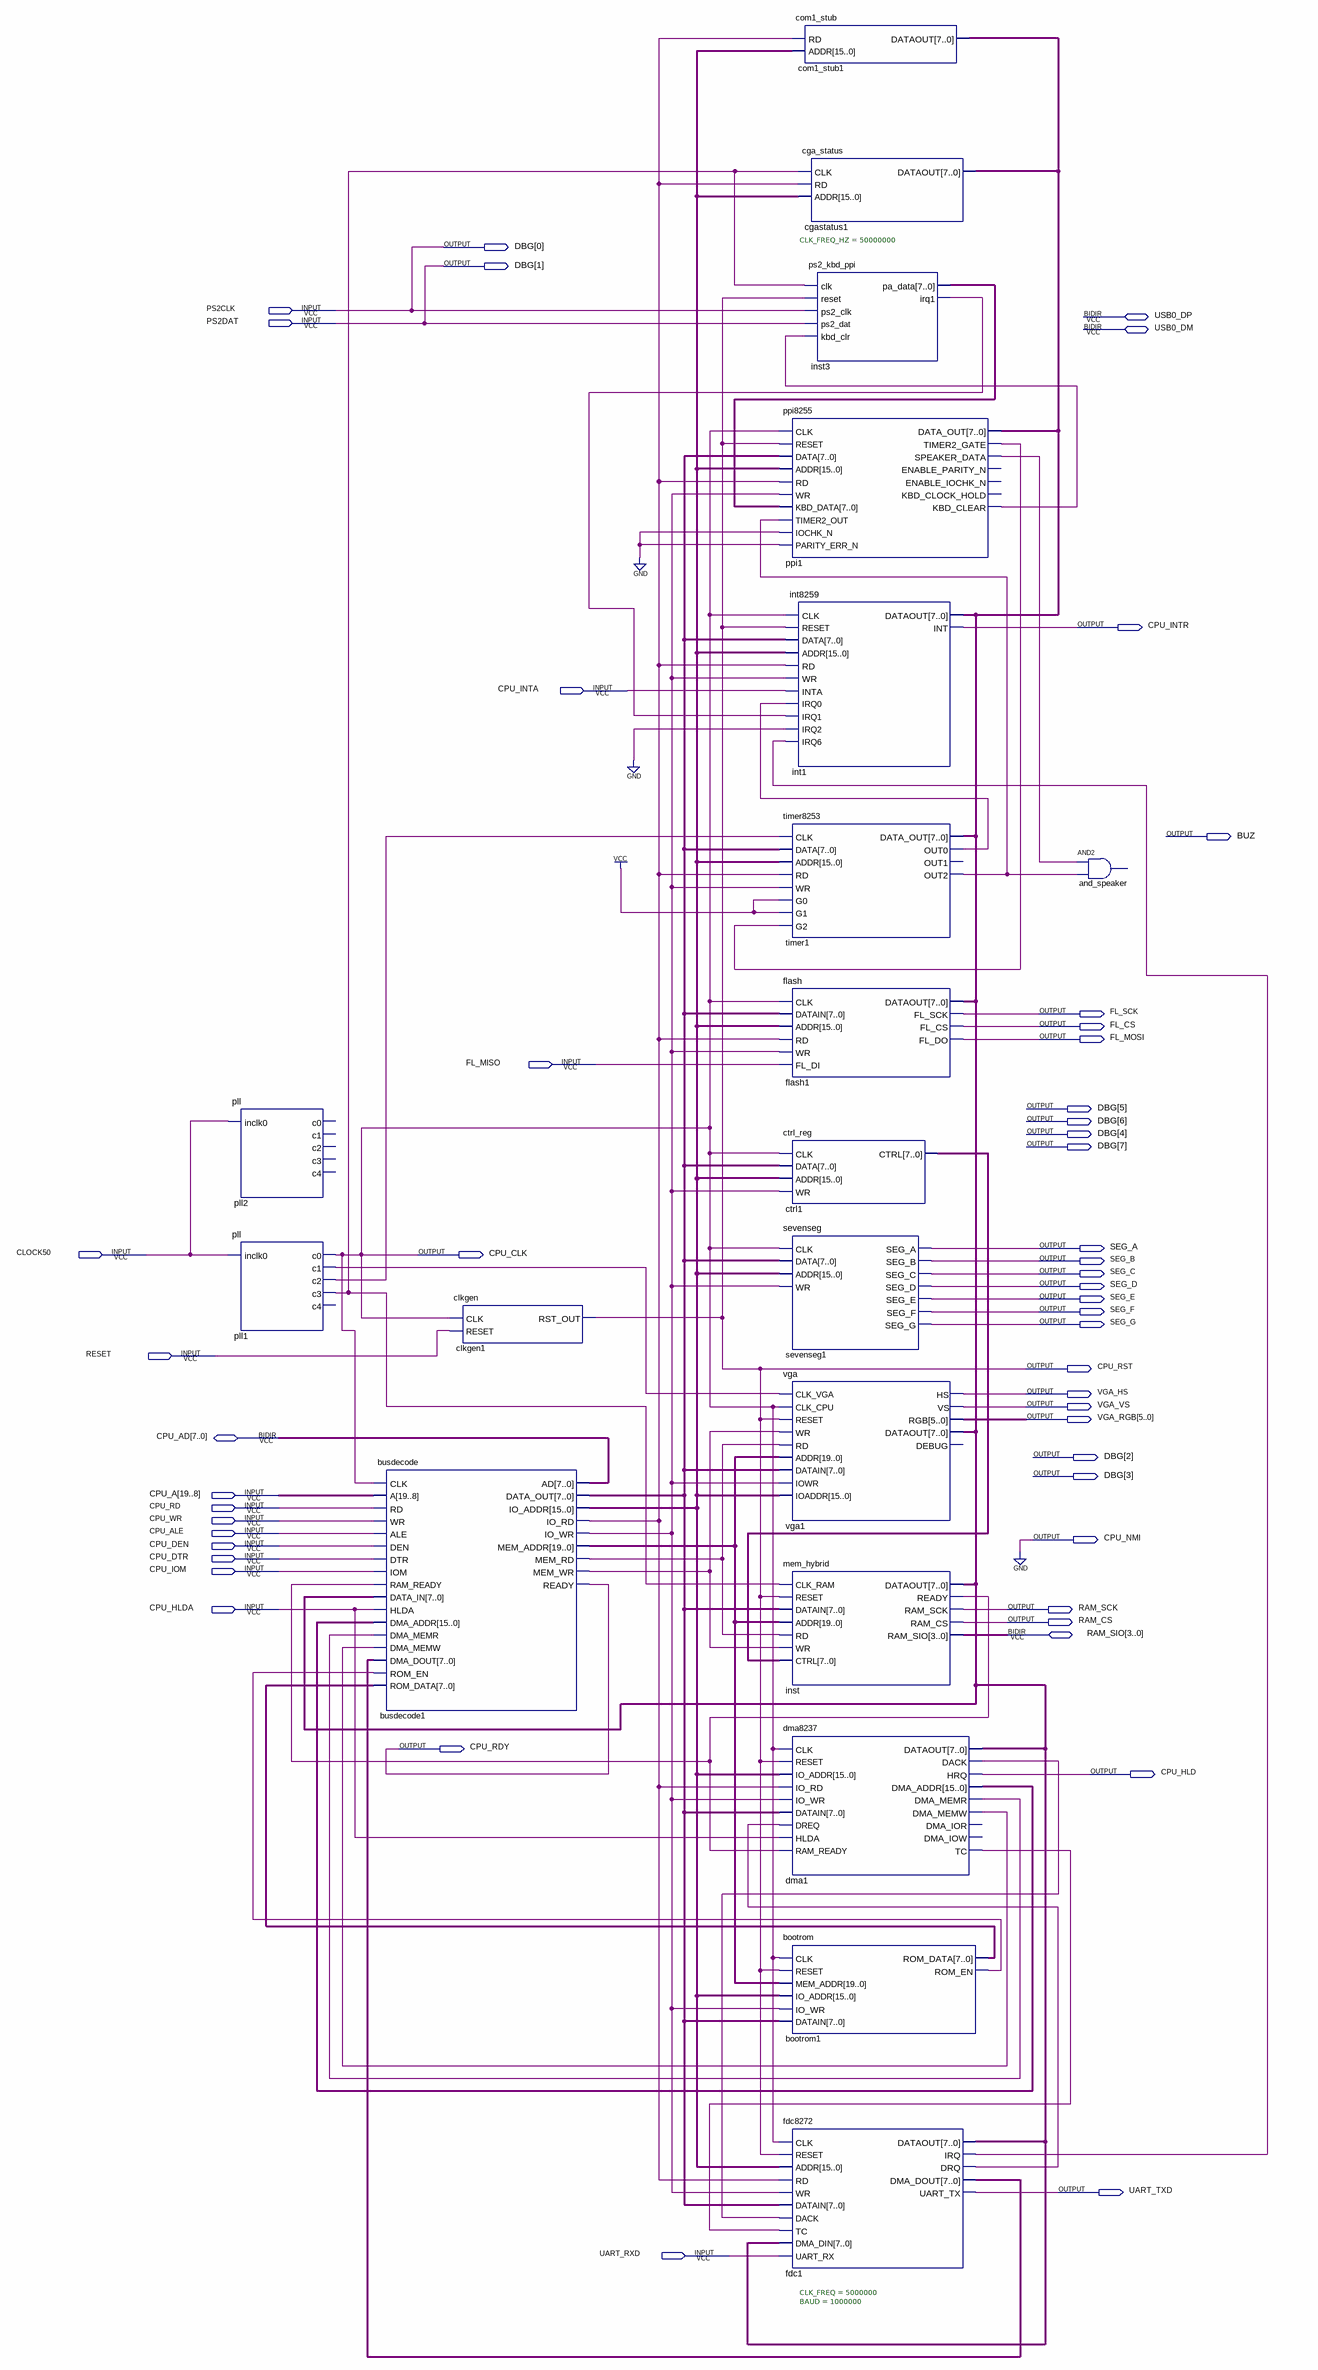
[diagram p0: schematic sheet]
// Quartus schematic gertieboard.bdf as structural Verilog: 19 symbols, 50 pins
module gertieboard (
  input  PS2CLK,
  input  PS2DAT,
  input  CPU_INTA,
  input  FL_MISO,
  input  CLOCK50,
  input  RESET,
  input  [19:8] CPU_A,
  input  CPU_RD,
  input  CPU_WR,
  input  CPU_ALE,
  input  CPU_DEN,
  input  CPU_DTR,
  input  CPU_IOM,
  input  CPU_HLDA,
  input  UART_RXD,
  inout  USB0_DP,
  inout  USB0_DM,
  inout  [7:0] CPU_AD,
  inout  [3:0] RAM_SIO,
  output [7:0] DBG,
  output CPU_INTR,
  output BUZ,
  output FL_SCK,
  output FL_CS,
  output FL_MOSI,
  output SEG_A,
  output CPU_CLK,
  output SEG_B,
  output SEG_C,
  output SEG_D,
  output SEG_E,
  output SEG_F,
  output SEG_G,
  output CPU_RST,
  output VGA_HS,
  output VGA_VS,
  output [5:0] VGA_RGB,
  output CPU_NMI,
  output RAM_SCK,
  output RAM_CS,
  output CPU_RDY,
  output CPU_HLD,
  output UART_TXD
);

  wire bootrom1_rom_en, busdecode1_io_rd, busdecode1_io_wr, busdecode1_mem_rd, busdecode1_mem_wr, dma1_dack,
       dma1_dma_memr, dma1_dma_memw, dma1_tc, fdc1_drq, fdc1_irq, inst3_irq1, inst_ready, pll1_c1, pll1_c2,
       pll1_c3, ppi1_kbd_clear, ppi1_speaker_data, ppi1_timer2_gate, timer1_out0, timer1_out2;
  wire [7:0] bootrom1_rom_data, busdecode1_data_out, com1_stub1_dataout, ctrl1_ctrl, fdc1_dma_dout,
       inst3_pa_data;
  wire [15:0] busdecode1_io_addr, dma1_dma_addr;
  wire [19:0] busdecode1_mem_addr;

  pll pll2 (.inclk0(CLOCK50));  // open: c0, c1, c2, c3, c4
  pll pll1 (.inclk0(CLOCK50), .c0(CPU_CLK), .c1(pll1_c1), .c2(pll1_c2), .c3(pll1_c3));  // open: c4
  busdecode busdecode1 (
    .CLK(CPU_CLK), .A(CPU_A), .RD(CPU_RD), .WR(CPU_WR), .ALE(CPU_ALE), .DEN(CPU_DEN), .DTR(CPU_DTR),
    .IOM(CPU_IOM), .RAM_READY(inst_ready), .DATA_IN(com1_stub1_dataout), .HLDA(CPU_HLDA),
    .DMA_ADDR(dma1_dma_addr), .DMA_MEMR(dma1_dma_memr), .DMA_MEMW(dma1_dma_memw), .DMA_DOUT(fdc1_dma_dout),
    .ROM_EN(bootrom1_rom_en), .ROM_DATA(bootrom1_rom_data), .DATA_OUT(busdecode1_data_out),
    .IO_ADDR(busdecode1_io_addr), .IO_RD(busdecode1_io_rd), .IO_WR(busdecode1_io_wr),
    .MEM_ADDR(busdecode1_mem_addr), .MEM_RD(busdecode1_mem_rd), .MEM_WR(busdecode1_mem_wr), .READY(CPU_RDY),
    .AD(CPU_AD));
  clkgen clkgen1 (.CLK(CPU_CLK), .RESET(RESET), .RST_OUT(CPU_RST));
  com1_stub com1_stub1 (.RD(busdecode1_io_rd), .ADDR(busdecode1_io_addr), .DATAOUT(com1_stub1_dataout));
  cga_status cgastatus1 (.CLK(pll1_c3), .RD(busdecode1_io_rd), .ADDR(busdecode1_io_addr), .DATAOUT(com1_stub1_dataout));
  ps2_kbd_ppi #(.CLK_FREQ_HZ(50000000)) inst3 (
    .clk(pll1_c3), .reset(CPU_RST), .ps2_clk(PS2CLK), .ps2_dat(PS2DAT), .kbd_clr(ppi1_kbd_clear),
    .pa_data(inst3_pa_data), .irq1(inst3_irq1));
  ppi8255 ppi1 (
    .CLK(CPU_CLK), .RESET(CPU_RST), .DATA(busdecode1_data_out), .ADDR(busdecode1_io_addr),
    .RD(busdecode1_io_rd), .WR(busdecode1_io_wr), .KBD_DATA(inst3_pa_data), .TIMER2_OUT(timer1_out2),
    .IOCHK_N(1'b0), .PARITY_ERR_N(1'b0), .DATA_OUT(com1_stub1_dataout), .TIMER2_GATE(ppi1_timer2_gate),
    .SPEAKER_DATA(ppi1_speaker_data), .KBD_CLEAR(ppi1_kbd_clear));  // open: ENABLE_PARITY_N, ENABLE_IOCHK_N, KBD_CLOCK_HOLD
  int8259 int1 (
    .CLK(CPU_CLK), .RESET(CPU_RST), .DATA(busdecode1_data_out), .ADDR(busdecode1_io_addr),
    .RD(busdecode1_io_rd), .WR(busdecode1_io_wr), .INTA(CPU_INTA), .IRQ0(timer1_out0), .IRQ1(inst3_irq1),
    .IRQ2(1'b0), .IRQ6(fdc1_irq), .DATAOUT(com1_stub1_dataout), .INT(CPU_INTR));
  timer8253 timer1 (
    .CLK(pll1_c2), .DATA(busdecode1_data_out), .ADDR(busdecode1_io_addr), .RD(busdecode1_io_rd),
    .WR(busdecode1_io_wr), .G0(1'b1), .G1(1'b1), .G2(ppi1_timer2_gate), .DATA_OUT(com1_stub1_dataout),
    .OUT0(timer1_out0), .OUT2(timer1_out2));  // open: OUT1
  flash flash1 (
    .CLK(CPU_CLK), .DATAIN(busdecode1_data_out), .ADDR(busdecode1_io_addr), .RD(busdecode1_io_rd),
    .WR(busdecode1_io_wr), .FL_DI(FL_MISO), .DATAOUT(com1_stub1_dataout), .FL_SCK(FL_SCK), .FL_CS(FL_CS),
    .FL_DO(FL_MOSI));
  ctrl_reg ctrl1 (
    .CLK(CPU_CLK), .DATA(busdecode1_data_out), .ADDR(busdecode1_io_addr), .WR(busdecode1_io_wr),
    .CTRL(ctrl1_ctrl));
  sevenseg sevenseg1 (
    .CLK(CPU_CLK), .DATA(busdecode1_data_out), .ADDR(busdecode1_io_addr), .WR(busdecode1_io_wr),
    .SEG_A(SEG_A), .SEG_B(SEG_B), .SEG_C(SEG_C), .SEG_D(SEG_D), .SEG_E(SEG_E), .SEG_F(SEG_F), .SEG_G(SEG_G));
  vga vga1 (
    .CLK_VGA(pll1_c1), .CLK_CPU(CPU_CLK), .RESET(CPU_RST), .WR(busdecode1_mem_wr), .RD(busdecode1_mem_rd),
    .ADDR(busdecode1_mem_addr), .DATAIN(busdecode1_data_out), .IOWR(busdecode1_io_wr),
    .IOADDR(busdecode1_io_addr), .HS(VGA_HS), .VS(VGA_VS), .RGB(VGA_RGB), .DATAOUT(com1_stub1_dataout));  // open: DEBUG
  mem_hybrid inst (
    .CLK_RAM(pll1_c3), .RESET(CPU_RST), .DATAIN(busdecode1_data_out), .ADDR(busdecode1_mem_addr),
    .RD(busdecode1_mem_rd), .WR(busdecode1_mem_wr), .CTRL(ctrl1_ctrl), .READY(inst_ready), .RAM_SCK(RAM_SCK),
    .RAM_CS(RAM_CS), .DATAOUT(com1_stub1_dataout), .RAM_SIO(RAM_SIO));
  dma8237 dma1 (
    .CLK(CPU_CLK), .RESET(CPU_RST), .IO_ADDR(busdecode1_io_addr), .IO_RD(busdecode1_io_rd),
    .IO_WR(busdecode1_io_wr), .DATAIN(busdecode1_data_out), .DREQ(fdc1_drq), .HLDA(CPU_HLDA),
    .RAM_READY(inst_ready), .DACK(dma1_dack), .HRQ(CPU_HLD), .DMA_ADDR(dma1_dma_addr),
    .DMA_MEMR(dma1_dma_memr), .DMA_MEMW(dma1_dma_memw), .TC(dma1_tc), .DATAOUT(com1_stub1_dataout));  // open: DMA_IOR, DMA_IOW
  bootrom bootrom1 (
    .CLK(CPU_CLK), .RESET(CPU_RST), .MEM_ADDR(busdecode1_mem_addr), .IO_ADDR(busdecode1_io_addr),
    .IO_WR(busdecode1_io_wr), .DATAIN(busdecode1_data_out), .ROM_DATA(bootrom1_rom_data),
    .ROM_EN(bootrom1_rom_en));
  fdc8272 #(.CLK_FREQ(5000000), .BAUD(1000000)) fdc1 (
    .CLK(CPU_CLK), .RESET(CPU_RST), .ADDR(busdecode1_io_addr), .RD(busdecode1_io_rd), .WR(busdecode1_io_wr),
    .DATAIN(busdecode1_data_out), .DACK(dma1_dack), .TC(dma1_tc), .DMA_DIN(com1_stub1_dataout),
    .UART_RX(UART_RXD), .DATAOUT(com1_stub1_dataout), .IRQ(fdc1_irq), .DRQ(fdc1_drq),
    .DMA_DOUT(fdc1_dma_dout), .UART_TX(UART_TXD));
  // AND2 and_speaker has open pins: IN1=ppi1_speaker_data, IN2=timer1_out2, OUT=open

  assign CPU_NMI = 1'b0;
  assign DBG[1:0] = {PS2DAT, PS2CLK};
endmodule
